# EAGLE design nRF51822_Module_Adapter (EAGLE 7.6.0)
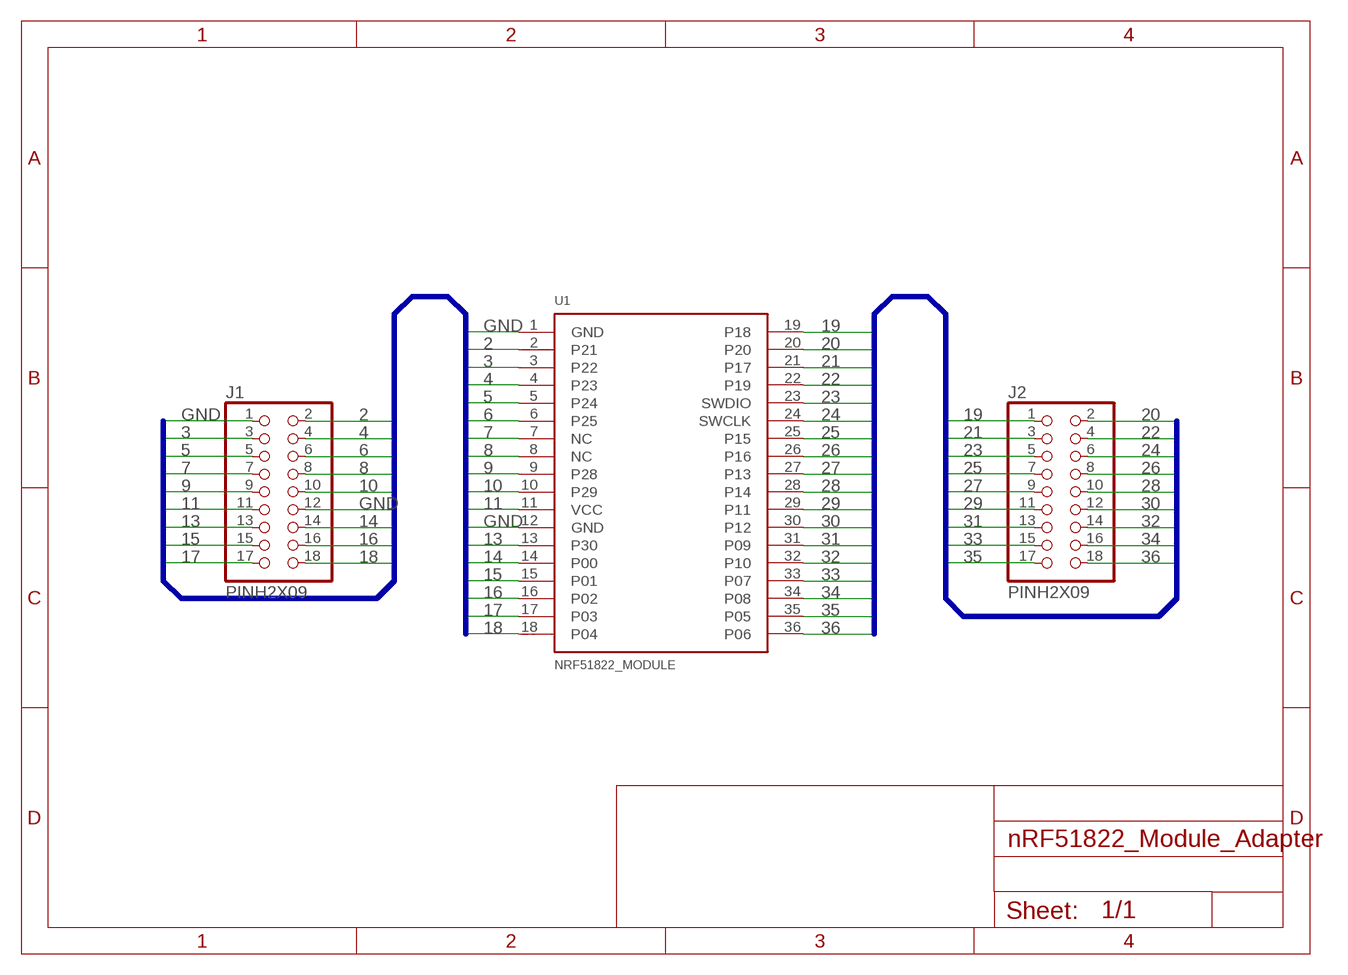
[diagram p0: schematic, sheet 1]

## Parts
J1  PINH2X09  [PINH2X09]
J2  PINH2X09  [PINH2X09]
U1  NRF51822_MODULE  [NRF51822_MODULE]

## Nets
2: J1.2 U1.2(P21)
3: J1.3 U1.3(P22)
4: J1.4 U1.4(P23)
5: J1.5 U1.5(P24)
6: J1.6 U1.6(P25)
7: J1.7 U1.7(NC)
8: J1.8 U1.8(NC)
9: J1.9 U1.9(P28)
10: J1.10 U1.10(P29)
11: J1.11 U1.11(VCC)
13: J1.13 U1.13(P30)
14: J1.14 U1.14(P00)
15: J1.15 U1.15(P01)
16: J1.16 U1.16(P02)
17: J1.17 U1.17(P03)
18: J1.18 U1.18(P04)
19: J2.1 U1.19(P18)
20: J2.2 U1.20
21: J2.3 U1.21(P17)
22: J2.4 U1.22(P19)
23: J2.5 U1.23(SWDIO)
24: J2.6 U1.24(SWCLK)
25: J2.7 U1.25(P15)
26: J2.8 U1.26(P16)
27: J2.9 U1.27(P13)
28: J2.10 U1.28(P14)
29: J2.11 U1.29(P11)
30: J2.12 U1.30(P12)
31: J2.13 U1.31(P09)
32: J2.14 U1.32(P10)
33: J2.15 U1.33(P07)
34: J2.16 U1.34(P08)
35: J2.17 U1.35(P05)
36: J2.18 U1.36(P06)
GND: J1.1 J1.12 U1.1(GND) U1.12(GND)

## Buses
B$1
B$2

## Library data of the parts
J1 J2 = #afb-Connectors:PINH2X09
U1 = #afb-Boards:NRF51822_MODULE: Core nRF51822 Module - 36 Pins 2.0 mm Pitch

## Board
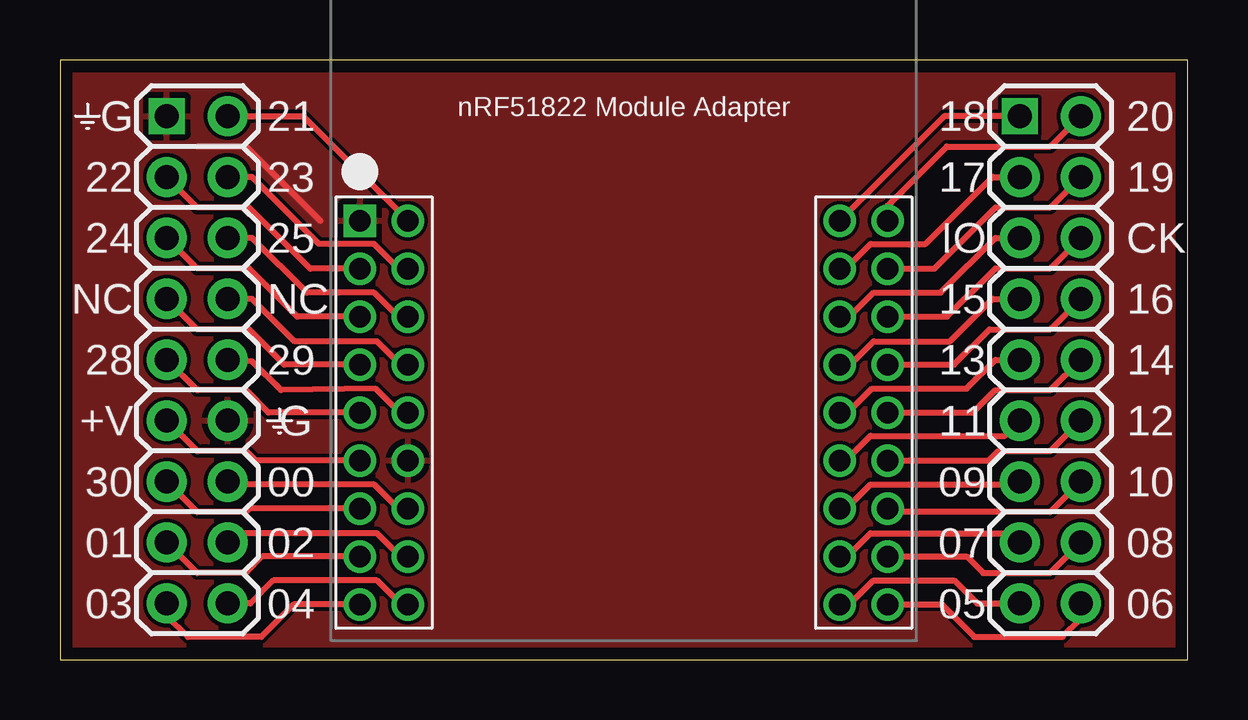
[diagram p1: board, top side]
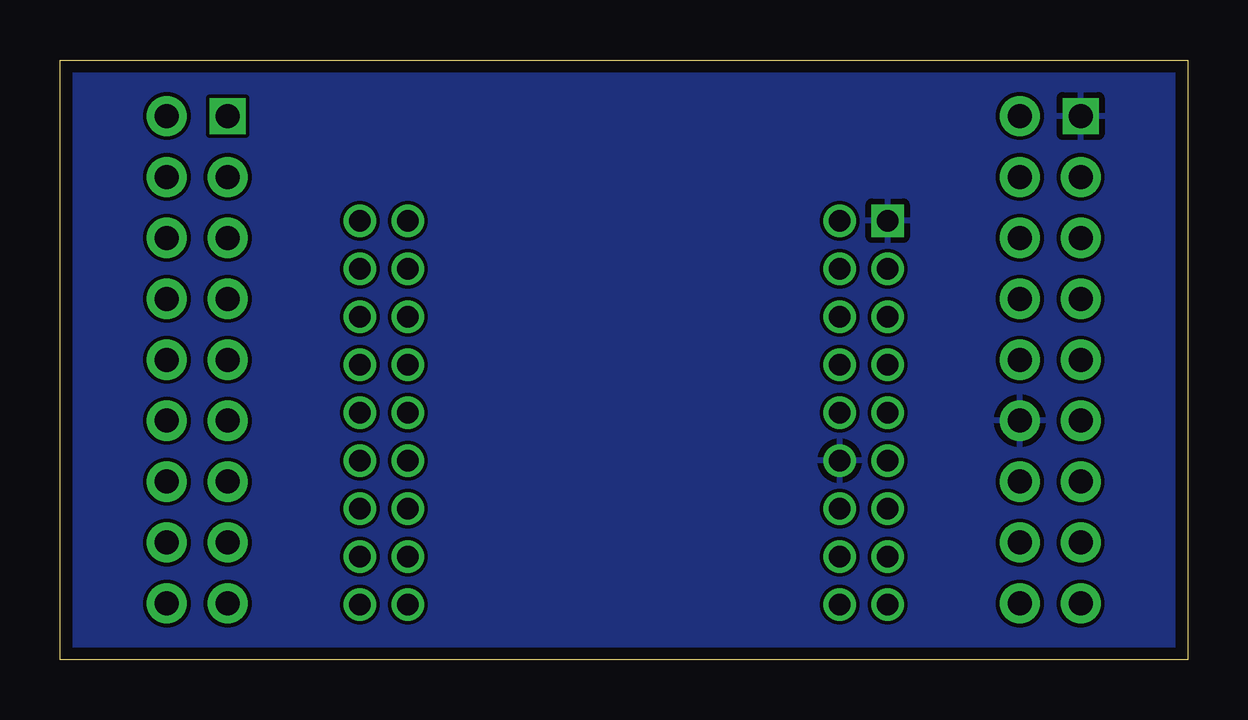
[diagram p2: board, bottom side, seen from below]

Size 47 x 25 mm. Coordinates in mm from the lower left corner, seen from the top.
Outline: 0,0 47,0 47,25 0,25 0,0
Copper layers (1*16): Top 0.035mm / dielectric 1.6mm / Bottom 0.035mm
Design rules "Elecrow_2-layer_PCB_eagle_rule": minimum track width 6mil, minimum drill 12mil, track to track 6mil, track to pad 6mil, pad to pad 6mil, via to via 8mil, smd to smd 0mil, copper to edge 20mil, drill to drill 10mil, minimum pad ring 6mil, minimum via ring 6mil, stop-mask expansion 0mil, vias tented up to drill 100mil, thermal gap 10mil

### Footprints (pad centres in the part's own frame; a part is rotated, then mirrored left to right if it is on the bottom)
PINH2X09 = drill 1 square: 1 -10.16,-1.27 | drill 1 pad 1.676: 2 -10.16,1.27; 3 -7.62,-1.27; 4 -7.62,1.27; 5 -5.08,-1.27; 6 -5.08,1.27; 7 -2.54,-1.27; 8 -2.54,1.27; 9 0,-1.27; 10 0,1.27; 11 2.54,-1.27; 12 2.54,1.27; 13 5.08,-1.27; 14 5.08,1.27; 15 7.62,-1.27; 16 7.62,1.27; 17 10.16,-1.27; 18 10.16,1.27
NRF51822_MODULE = drill 0.9 pad 1.27 square: 1 -11,1.35 | drill 0.9: 2 -9,1.35; 3 -11,-0.65; 4 -9,-0.65; 5 -11,-2.65; 6 -9,-2.65; 7 -11,-4.65; 8 -9,-4.65; 9 -11,-6.65; 10 -9,-6.65; 11 -11,-8.65; 12 -9,-8.65; 13 -11,-10.65; 14 -9,-10.65; 15 -11,-12.65; 16 -9,-12.65; 17 -11,-14.65; 18 -9,-14.65; 19 9,1.35; 20 11,1.35; 21 9,-0.65; 22 11,-0.65; 23 9,-2.65; 24 11,-2.65; 25 9,-4.65; 26 11,-4.65; 27 9,-6.65; 28 11,-6.65; 29 9,-8.65; 30 11,-8.65; 31 9,-10.65; 32 11,-10.65; 33 9,-12.65; 34 11,-12.65; 35 9,-14.65; 36 11,-14.65

### Placement (x,y rotation side)
J1  5.72,12.5 270 top
J2  41.28,12.5 270 top
U1  23.5,16.95 0 top

### Tracks (layer width: path | path; a pad name or v marks a point on that pad's centre or on a via)
2
  Top 0.254: J1.2 10.13,22.66 U1.2
3
  Top 0.254: U1.3 10.43,16.3 7.88,18.85 5.72,18.85 J1.3
4
  Top 0.254: U1.4 14.12,16.3 13.09,17.33 10.8,17.33 8.01,20.12 J1.4
5
  Top 0.254: U1.5 9.89,14.29 7.88,16.31 5.72,16.31 J1.5
6
  Top 0.254: U1.6 14.09,14.29 13.09,15.29 10.29,15.29 8.01,17.58 J1.6
7
  Top 0.254: U1.7 9.35,12.29 7.88,13.77 5.72,13.77 J1.7
8
  Top 0.254: U1.8 14.18,12.29 13.21,13.26 9.78,13.26 8.01,15.04 J1.8
9
  Top 0.254: U1.9 8.69,10.29 7.75,11.23 5.72,11.23 J1.9
10
  Top 0.254: U1.10 14.15,10.29 13.15,11.29 9.21,11.23 8.01,12.44 J1.10
11
  Top 0.254: U1.11 8.15,8.29 7.75,8.69 5.72,8.69 J1.11
13
  Top 0.254: U1.13 7.9,6.29 7.75,6.15 5.72,6.15 J1.13
14
  Top 0.254: U1.14 14.08,6.29 13.09,7.29 7.12,7.29 J1.14
15
  Top 0.254: U1.15 8.44,4.29 7.75,3.61 5.72,3.61 J1.15
16
  Top 0.254: U1.16 14.18,4.29 13.21,5.26 7.37,5.26 J1.16
17
  Top 0.254: U1.17 9.74,2.29 8.39,0.94 5.34,0.94 4.45,1.83 J1.17
18
  Top 0.254: U1.18 14.21,2.29 13.21,3.29 8.89,3.29 7.94,2.34 J1.18
19
  Top 0.254: J2.1 36.87,22.66 U1.19
20
  Top 0.254: U1.20 34.5,18.93 36.96,21.39 41.28,21.39 J2.2
21
  Top 0.254: U1.21 32.76,16.3 33.79,17.33 36.07,17.33 38.87,20.12 J2.3
22
  Top 0.254: U1.22 36.44,16.3 38.99,18.85 41.28,18.85 J2.4
23
  Top 0.254: U1.23 32.91,14.29 33.91,15.29 36.71,15.29 38.99,17.58 J2.5
24
  Top 0.254: U1.24 36.98,14.29 38.99,16.31 41.28,16.31 J2.6
25
  Top 0.254: U1.25 32.95,12.29 33.91,13.26 37.09,13.26 38.87,15.04 J2.7
26
  Top 0.254: U1.26 37.27,12.29 38.74,13.77 41.28,13.77 J2.8
27
  Top 0.254: U1.27 32.85,10.29 33.85,11.29 37.79,11.29 38.99,12.5 J2.9
28
  Top 0.254: U1.28 38.06,10.29 38.99,11.23 41.28,11.23 J2.10
29
  Top 0.254: U1.29 32.76,8.29 33.79,9.32 39.38,9.32 J2.11
30
  Top 0.254: U1.30 38.73,8.29 39.12,8.69 41.28,8.69 J2.12
31
  Top 0.254: U1.31 32.79,6.29 33.79,7.29 39.88,7.29 J2.13
32
  Top 0.254: J2.14 41.28,6.15 34.64,6.15 U1.32
33
  Top 0.254: U1.33 32.82,4.29 33.79,5.26 39.63,5.26 J2.15
34
  Top 0.254: U1.34 37.8,4.29 38.49,3.61 41.28,3.61 J2.16
35
  Top 0.254: U1.35 32.92,2.29 33.91,3.29 37.28,3.29 38.23,2.34 J2.17
36
  Top 0.254: U1.36 36.75,2.29 38.11,0.94 41.79,0.94 42.55,1.71 J2.18
GND
  Top 0.254: 10.85,18.3 7.75,21.39 5.72,21.39
  pour Top: 0,25 47,25 47,0 0,0
  pour Bottom: 0,25 47,25 47,0 0,0

### Text on the board
tNames: G | 21 | nRF51822 Module Adapter | 18 | 20 | 22 | 23 | 17 | 19 | 24 | 25 | IO | CK | NC | NC | 15 | 16 | 28 | 29 | 13 | 14 | +V | G | 11 | 12 | 30 | 00 | 09 | 10 | 01 | 02 | 07 | 08 | 03 | 04 | 05 | 06